# Altium schematic sheet High_Side_FETs_Parallel.SchDoc
size A4; Organization: TESLA Motors, INC; Address1: 3500 Deer Creek Road; Address2: Palo Alto, CA; Address4: U.S.A.; SheetNumber: 7; SheetTotal: 9
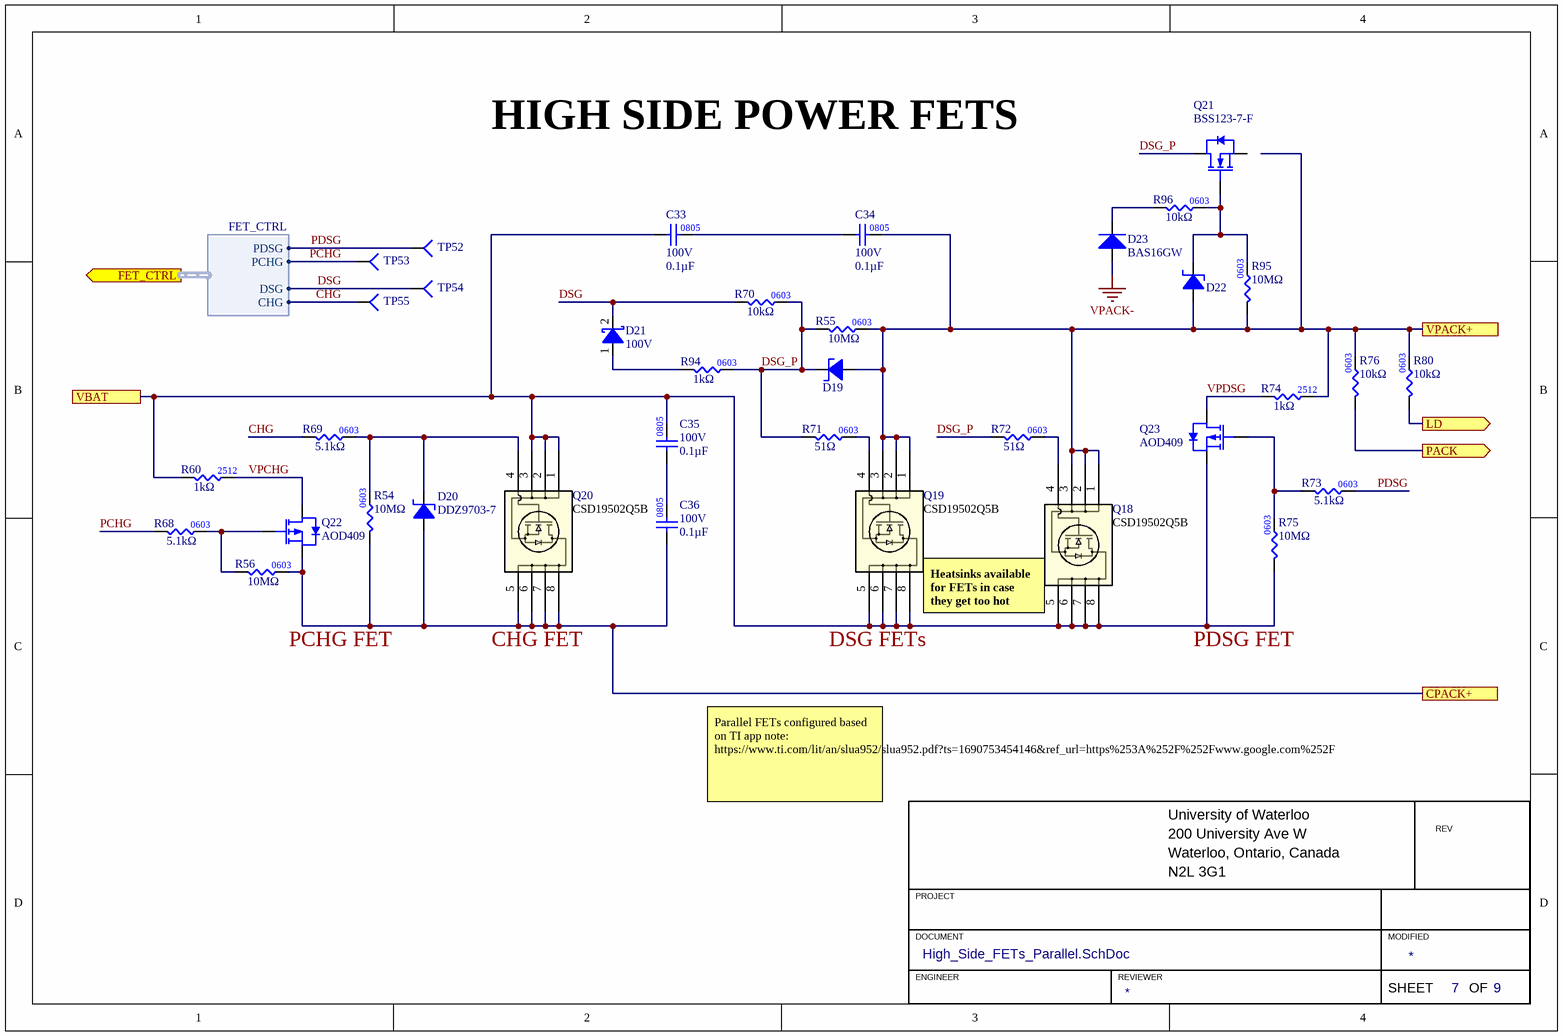
[diagram p0: High_Side_FETs_Parallel.SchDoc]

## Parts
C33  value 0.1µF  Voltage Rating: 100V  [CAP0805]  (hidden comment: CAP_0.1uF_100V_0805)
C34  value 0.1µF  Voltage Rating: 100V  [CAP0805]  (hidden comment: CAP_0.1uF_100V_0805)
C35  value 0.1µF  Voltage Rating: 100V  [CAP0805]  (hidden comment: CAP_0.1uF_100V_0805)
C36  value 0.1µF  Voltage Rating: 100V  [CAP0805]  (hidden comment: CAP_0.1uF_100V_0805)
D19  DIO_ZENER_16V  [SOD-123_FLAT]  (value not drawn)
D20  Manufacturer Part Number 1: DDZ9703-7  [SOD-123_FLAT]  (hidden comment: DIO_ZENER_16V)
D21  Vr (Max): 100V  [SOD-123_FLAT]  (hidden comment: DIO_SCHOTTKY_100V_1A)
D22  DIO_ZENER_16V  [SOD-123_FLAT]  (value not drawn)
D23  Manufacturer Part Number 1: BAS16GW  [DIODSOD-123]  (hidden comment: DIO_100V_215mA)
Q18  CSD19502Q5B  [DFN5060]
Q19  CSD19502Q5B  [DFN5060]
Q20  CSD19502Q5B  [DFN5060]
Q21  Manufacturer Part Number 1: BSS123-7-F  [SOT23-3]  (hidden comment: NMOS_100V_170mA)
Q22  Manufacturer Part Number 1: AOD409  [TO-252 AOSMD]  (hidden comment: PMOS_60V_26A)
Q23  Manufacturer Part Number 1: AOD409  [TO-252 AOSMD]  (hidden comment: PMOS_60V_26A)
R54  value 10MΩ  [RES0603]  (hidden comment: RES_10MΩ_0603_1%)
R55  value 10MΩ  [RES0603]  (hidden comment: RES_10MΩ_0603_1%)
R56  value 10MΩ  [RES0603]  (hidden comment: RES_10MΩ_0603_1%)
R60  value 1kΩ  [RES2512]  (hidden comment: RES_1kΩ_2512_1%)
R68  value 5.1kΩ  [RES0603]  (hidden comment: RES_5.1kΩ_0603_1%)
R69  value 5.1kΩ  [RES0603]  (hidden comment: RES_5.1kΩ_0603_1%)
R70  value 10kΩ  [RES0603]  (hidden comment: RES_10kΩ_0603_1%)
R71  value 51Ω  [RES0603]  (hidden comment: RES_51Ω_0603_1%)
R72  value 51Ω  [RES0603]  (hidden comment: RES_51Ω_0603_1%)
R73  value 5.1kΩ  [RES0603]  (hidden comment: RES_5.1kΩ_0603_1%)
R74  value 1kΩ  [RES2512]  (hidden comment: RES_1kΩ_2512_1%)
R75  value 10MΩ  [RES0603]  (hidden comment: RES_10MΩ_0603_1%)
R76  value 10kΩ  [RES0603]  (hidden comment: RES_10kΩ_0603_1%)
R80  value 10kΩ  [RES0603]  (hidden comment: RES_10kΩ_0603_1%)
R94  value 1kΩ  [RES0603]  (hidden comment: RES_1kΩ_0603_1%)
R95  value 10MΩ  [RES0603]  (hidden comment: RES_10MΩ_0603_1%)
R96  value 10kΩ  [RES0603]  (hidden comment: RES_10kΩ_0603_1%)
TP52  TESTPOINT_1MM_CIRCLE  [TESTPOINT_CIRCLE_1MM]  (value not drawn)  (no BOM)
TP53  TESTPOINT_1MM_CIRCLE  [TESTPOINT_CIRCLE_1MM]  (value not drawn)  (no BOM)
TP54  TESTPOINT_1MM_CIRCLE  [TESTPOINT_CIRCLE_1MM]  (value not drawn)  (no BOM)
TP55  TESTPOINT_1MM_CIRCLE  [TESTPOINT_CIRCLE_1MM]  (value not drawn)  (no BOM)

## Ports
CPACK+, FET_CTRL (out, harness FET_CTRL), LD (out), PACK (out), VBAT, VPACK+

## Harnesses
FET_CTRL: PDSG, PCHG, DSG, CHG

## Nets
VPACK-: D23.1(A)
CHG: R69.1 TP55.1(=value) ; port FET_CTRL.CHG
CPACK+: C36.1 D20.1(Anode) Q20.5(D) Q20.6(D) Q20.7(D) Q20.8(D) Q22.3(Source) R54.1 R56.2 ; port CPACK+
DSG: D21.2(Cathode) R70.1 TP54.1(=value) ; port FET_CTRL.DSG
DSG_P: D19.2(Cathode) Q21.3(DRAIN) R55.1 R70.2 R71.1 R72.1 R94.2
LD: R80.1 ; port LD
PACK: R76.1 ; port PACK
PCHG: R68.1 TP53.1(=value) ; port FET_CTRL.PCHG
PDSG: R73.2 TP52.1(=value) ; port FET_CTRL.PDSG
VBAT: C33.1 C35.2 Q18.5(D) Q18.6(D) Q18.7(D) Q18.8(D) Q19.5(D) Q19.6(D) Q19.7(D) Q19.8(D) Q20.1(S) Q20.2(S) Q20.3(S) Q23.3(Source) R60.1 R75.1 ; port VBAT
VPACK+: C34.2 D19.1(Anode) D22.1(Anode) Q18.1(S) Q18.2(S) Q18.3(S) Q19.1(S) Q19.2(S) Q19.3(S) R55.2 R74.2 R76.2 R80.2 R95.1 ; port VPACK+
VPCHG: Q22.2(Drain) R60.2
VPDSG: Q23.2(Drain) R74.1
NetC33_2: C33.2 C34.1
NetC35_1: C35.1 C36.2
NetD20_2: D20.2(Cathode) Q20.4(G) R54.2 R69.2
NetD21_1: D21.1(Anode) R94.1
NetD22_2: D22.2(Cathode) Q21.1(GATE) R95.2 R96.2
NetD23_2: D23.2(K) R96.1
NetQ18_4: Q18.4(G) R72.2
NetQ19_4: Q19.4(G) R71.2
NetQ22_1: Q22.1(Gate) R56.1 R68.2
NetQ23_1: Q23.1(Gate) R73.1 R75.2

Not connected (* = marked no-connect by the designer): Q21 2(SOURCE)

## Notes on the sheet
- HIGH SIDE POWER FETS
- PCHG FET
- CHG FET
- DSG FETs
- Heatsinks available for FETs in case they get too hot
- PDSG FET
- Parallel FETs configured based on TI app note: https://www.ti.com/lit/an/slua952/slua952.pdf?ts=1690753454146&ref_url=https%253A%252F%252Fwww.google.com%252F
- University of Waterloo
- 200 University Ave W
- REV
- PROJECT
- Waterloo, Ontario, Canada
- N2L 3G1
- DOCUMENT
- ENGINEER
- REVIEWER
- MODIFIED
- SHEET
- OF
- (in symbol RES_10MΩ_0603_1%) 0603
- (in symbol RES_51Ω_0603_1%) 0603

## Library data of the parts
C33-C36 = CAP_0.1uF_100V_0805: CAP CER 0.1UF 100V X7R 0805; Manufacturer 1: TDK Corporation; Manufacturer Part Number 1: C2012X7R2A104K125AA; Package: 0805; Supplier 1: Digi-Key; Supplier Part Number 1: 445-1418-1-ND
D19 D22 = DIO_ZENER_16V: DIODE ZENER 16V 500MW SOD123; Manufacturer Part Number 1: DDZ9703-7; Manufacturer 1: Diodes Incorporated; Forward Voltage: 900mV; Supplier 1: Digi-Key; Supplier Part Number 1: DDZ9703-7DICT-ND
D20 = DIO_ZENER_16V: DIODE ZENER 16V 500MW SOD123; Manufacturer 1: Diodes Incorporated; Forward Voltage: 900mV; Supplier 1: Digi-Key; Supplier Part Number 1: DDZ9703-7DICT-ND
D21 = DIO_SCHOTTKY_100V_1A: DIODE SCHOTTKY 100V 1A SOD-123F; Manufacturer 1: SMC Diode Solutions; Manufacturer Part Number 1: DSS110U; Supplier 1: Digi-Key; Supplier Part Number 1: 1655-DSS110UCT-ND; Mounting Type: SMD; Package/Footprint: SOD-123F
D23 = DIO_100V_215mA: DIODE GEN PURP 100V 215MA SOD123; Manufacturer 1: Nexperia; Package/Footprint: SOD-123; Package: SOD-123; Supplier Part Number 1: 1727-7320-1-ND; Supplier 1: Digi-Key; Mounting Type: SMD; Verified: No
Q18-Q20 = NMOS_CSD19502Q5B_80V_100A: MOSFET N-CH 80V 100A 8VSON; Manufacturer 1: Texas Instruments; Vgs (Max): ±20V; Package/Footprint: 8-PowerTDFN; Vdss (Max): 80V; Id: 100A; Supplier 1: Digi-Key; Supplier Part Number 1: 296-37194-1-ND; Manufacturer Part Number 1: CSD19502Q5B
Q21 = NMOS_100V_170mA: MOSFET N-CH 100V 170MA SOT23-3; Manufacturer 1: Diodes Incorporated; Supplier 1: Digi-Key; Supplier Part Number 1: BSS123-FDICT-ND
Q22 Q23 = PMOS_60V_26A: MOSFET P-CH 60V 26A TO252; Manufacturer 1: Alpha & Omega Semiconductor Inc.; Vgs (Max): ±20V; Vdss: 60V; Mounting Type: SMD; Id: 26A; Supplier 1: Digi-Key; Supplier Part Number 1: 785-1103-1-ND
R54-R56 R75 R95 = RES_10MΩ_0603_1%: RES 10M OHM 1% 1/10W 0603; Manufacturer 1: YAGEO; Manufacturer Part Number 1: RC0603FR-0710ML; Supplier 1: Digi-Key; Supplier Part Number 1: 311-10.0MHRCT-ND
R60 R74 = RES_1kΩ_2512_1%: RES SMD 1K OHM 1% 3W 2512; Manufacturer 1: TE Connectivity Passive Product; Manufacturer Part Number 1: 35221K0FT; Supplier Part Number 1: A121161CT-ND; Supplier 1: Digi-Key; Mounting Type: SMD; Package: 2512
R68 R69 R73 = RES_5.1kΩ_0603_1%: RES 5.1K OHM 1% 1/10W 0603; Manufacturer 1: YAGEO; Manufacturer Part Number 1: RC0603FR-135K1L; Mounting Type: SMD; Package: 0603; Supplier 1: Digi-Key; Supplier Part Number 1: 13-RC0603FR-135K1LCT-ND
R70 R76 R80 R96 = RES_10kΩ_0603_1%: RES 10K OHM 1% 1/8W 0603; Manufacturer 1: Stackpole Electronics Inc; Manufacturer Part Number 1: RNCP0603FTD10K0; Supplier Part Number 1: RNCP0603FTD10K0CT-ND; Supplier 1: Digi-Key; Mounting Type: SMD; Package: 0603
R71 R72 = RES_51Ω_0603_1%: RES 51 OHM 1% 1/10W 0603; Manufacturer 1: YAGEO; Manufacturer Part Number 1: RC0603FR-0751RL; Supplier 1: Digi-Key; Supplier Part Number 1: 311-51.0HRCT-ND
R94 = RES_1kΩ_0603_1%: RES 1K OHM 1% 1/8W 0603; Manufacturer 1: Stackpole Electronics Inc; Manufacturer Part Number 1: RNCP0603FTD1K00; Supplier Part Number 1: RNCP0603FTD1K00CT-ND; Supplier 1: Digi-Key; Mounting Type: SMD; Package: 0603
TP52-TP55 = TESTPOINT_1MM_CIRCLE: TESTPOINT 1MM CIRCLE